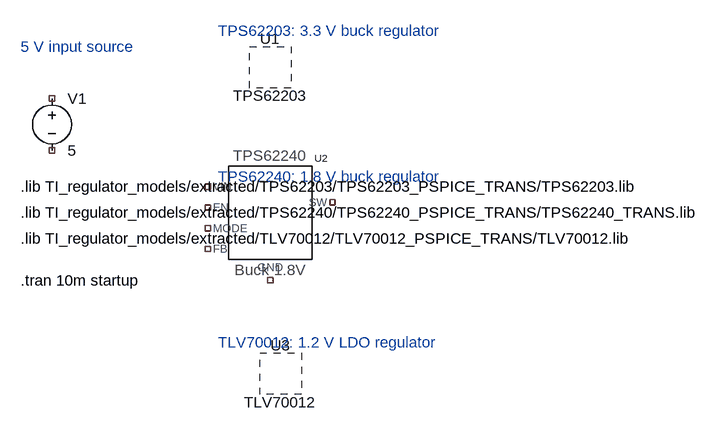
[diagram p0: schematic PowerRails_with_regulator_symbols.asc]
PowerRails_with_regulator_symbols.asc, the LTspice schematic file:
Version 4.1
SHEET 1 1360 860
SYMBOL voltage 96 112 R0
WINDOW 123 0 0 Left 0
WINDOW 39 0 0 Left 0
SYMATTR InstName V1
SYMATTR Value 5
SYMBOL TPS62203 432 80 R0
SYMATTR InstName U1
SYMBOL TPS62240_TRANS 432 304 R0
SYMATTR InstName U2
SYMBOL TLV70012 448 552 R0
SYMATTR InstName U3
TEXT 48 48 Left 2 ;5 V input source
TEXT 352 24 Left 2 ;TPS62203: 3.3 V buck regulator
TEXT 352 248 Left 2 ;TPS62240: 1.8 V buck regulator
TEXT 352 504 Left 2 ;TLV70012: 1.2 V LDO regulator
TEXT 48 264 Left 2 !.lib TI_regulator_models/extracted/TPS62203/TPS62203_PSPICE_TRANS/TPS62203.lib
TEXT 48 304 Left 2 !.lib TI_regulator_models/extracted/TPS62240/TPS62240_PSPICE_TRANS/TPS62240_TRANS.lib
TEXT 48 344 Left 2 !.lib TI_regulator_models/extracted/TLV70012/TLV70012_PSPICE_TRANS/TLV70012.lib
TEXT 48 408 Left 2 !.tran 10m startup

The netlist it stands for:
* PowerRails_with_regulator_symbols.asc
V1 NC_01 NC_02 5
* U1: TPS62203 (symbol TPS62203 not available, pin order unknown); nets seen at it: 
X§U2 NC_03 NC_04 NC_05 NC_06 NC_07 NC_08 TPS62240_TRANS  ; pins SW MODE FB EN VIN GND
* U3: TLV70012 (symbol TLV70012 not available, pin order unknown); nets seen at it: 
* 5 V input source
* TPS62203: 3.3 V buck regulator
* TPS62240: 1.8 V buck regulator
* TLV70012: 1.2 V LDO regulator
.lib TI_regulator_models/extracted/TPS62203/TPS62203_PSPICE_TRANS/TPS62203.lib
.lib TI_regulator_models/extracted/TPS62240/TPS62240_PSPICE_TRANS/TPS62240_TRANS.lib
.lib TI_regulator_models/extracted/TLV70012/TLV70012_PSPICE_TRANS/TLV70012.lib
.tran 10m startup
.backanno
.end